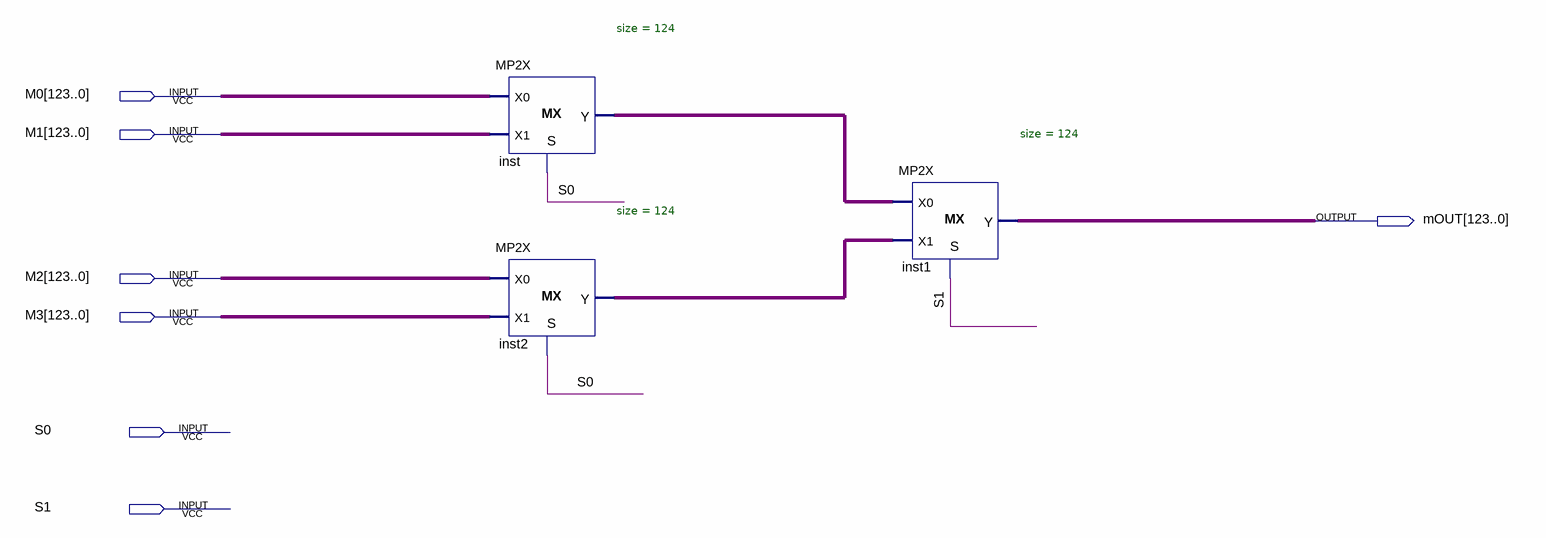
[diagram p0: schematic sheet]
// Quartus schematic MP4_124.bdf as structural Verilog: 3 symbols, 7 pins
module MP4_124 (
  input  [123:0] M0,
  input  [123:0] M1,
  input  [123:0] M2,
  input  [123:0] M3,
  input  S0,
  input  S1,
  output [123:0] mOUT
);

  wire [123:0] inst2_y, inst_y;

  MP2X #(.size(124)) inst (.S(S0), .X0(M0), .X1(M1), .Y(inst_y));
  MP2X #(.size(124)) inst2 (.S(S0), .X0(M2), .X1(M3), .Y(inst2_y));
  MP2X #(.size(124)) inst1 (.S(S1), .X0(inst_y), .X1(inst2_y), .Y(mOUT));
endmodule
